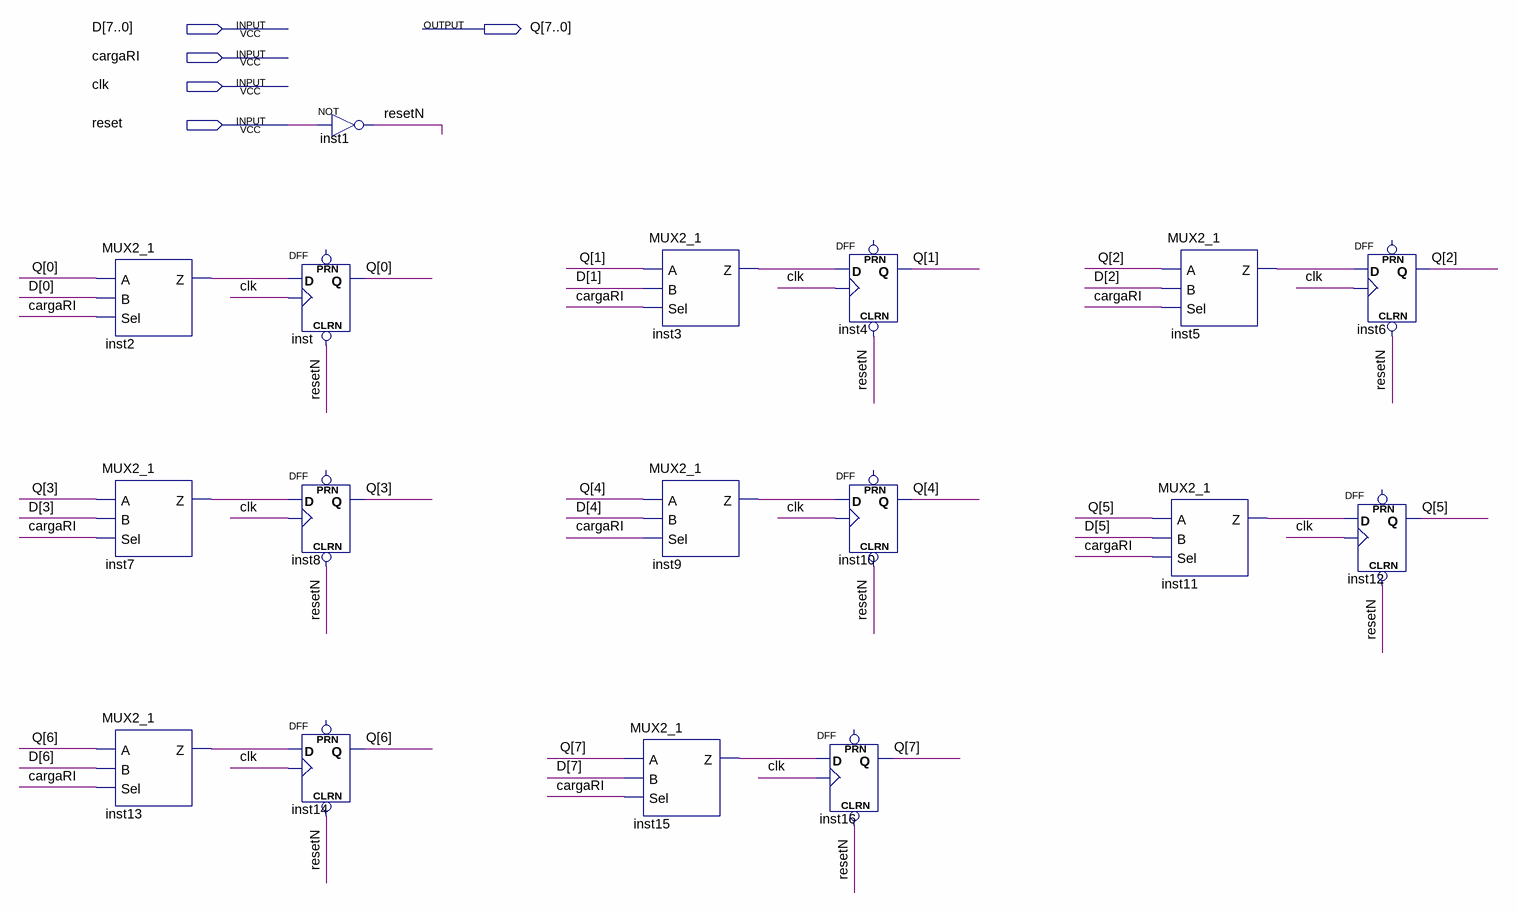
[diagram p0: schematic sheet]
// Quartus schematic RI.bdf as structural Verilog: 17 symbols, 5 pins
module RI (
  input  [7:0] D,
  input  cargaRI,
  input  clk,
  input  reset,
  output [7:0] Q
);

  wire inst2_z, inst3_z, inst5_z, inst7_z, inst9_z, inst11_z, inst13_z, inst15_z, resetN;

  MUX2_1 inst2 (.A(Q[0]), .B(D[0]), .Sel(cargaRI), .Z(inst2_z));
  MUX2_1 inst7 (.A(Q[3]), .B(D[3]), .Sel(cargaRI), .Z(inst7_z));
  MUX2_1 inst13 (.A(Q[6]), .B(D[6]), .Sel(cargaRI), .Z(inst13_z));
  not inst1 (resetN, reset);
  DFF inst (.CLRN(resetN), .CLK(clk), .D(inst2_z), .Q(Q[0]));  // open: PRN
  DFF inst8 (.CLRN(resetN), .CLK(clk), .D(inst7_z), .Q(Q[3]));  // open: PRN
  DFF inst14 (.CLRN(resetN), .CLK(clk), .D(inst13_z), .Q(Q[6]));  // open: PRN
  MUX2_1 inst3 (.A(Q[1]), .B(D[1]), .Sel(cargaRI), .Z(inst3_z));
  MUX2_1 inst9 (.A(Q[4]), .B(D[4]), .Sel(cargaRI), .Z(inst9_z));
  MUX2_1 inst15 (.A(Q[7]), .B(D[7]), .Sel(cargaRI), .Z(inst15_z));
  DFF inst4 (.CLRN(resetN), .CLK(clk), .D(inst3_z), .Q(Q[1]));  // open: PRN
  DFF inst10 (.CLRN(resetN), .CLK(clk), .D(inst9_z), .Q(Q[4]));  // open: PRN
  DFF inst16 (.CLRN(resetN), .CLK(clk), .D(inst15_z), .Q(Q[7]));  // open: PRN
  MUX2_1 inst5 (.A(Q[2]), .B(D[2]), .Sel(cargaRI), .Z(inst5_z));
  MUX2_1 inst11 (.A(Q[5]), .B(D[5]), .Sel(cargaRI), .Z(inst11_z));
  DFF inst6 (.CLRN(resetN), .CLK(clk), .D(inst5_z), .Q(Q[2]));  // open: PRN
  DFF inst12 (.CLRN(resetN), .CLK(clk), .D(inst11_z), .Q(Q[5]));  // open: PRN
endmodule
